# EAGLE design controller (EAGLE 6.6.0)
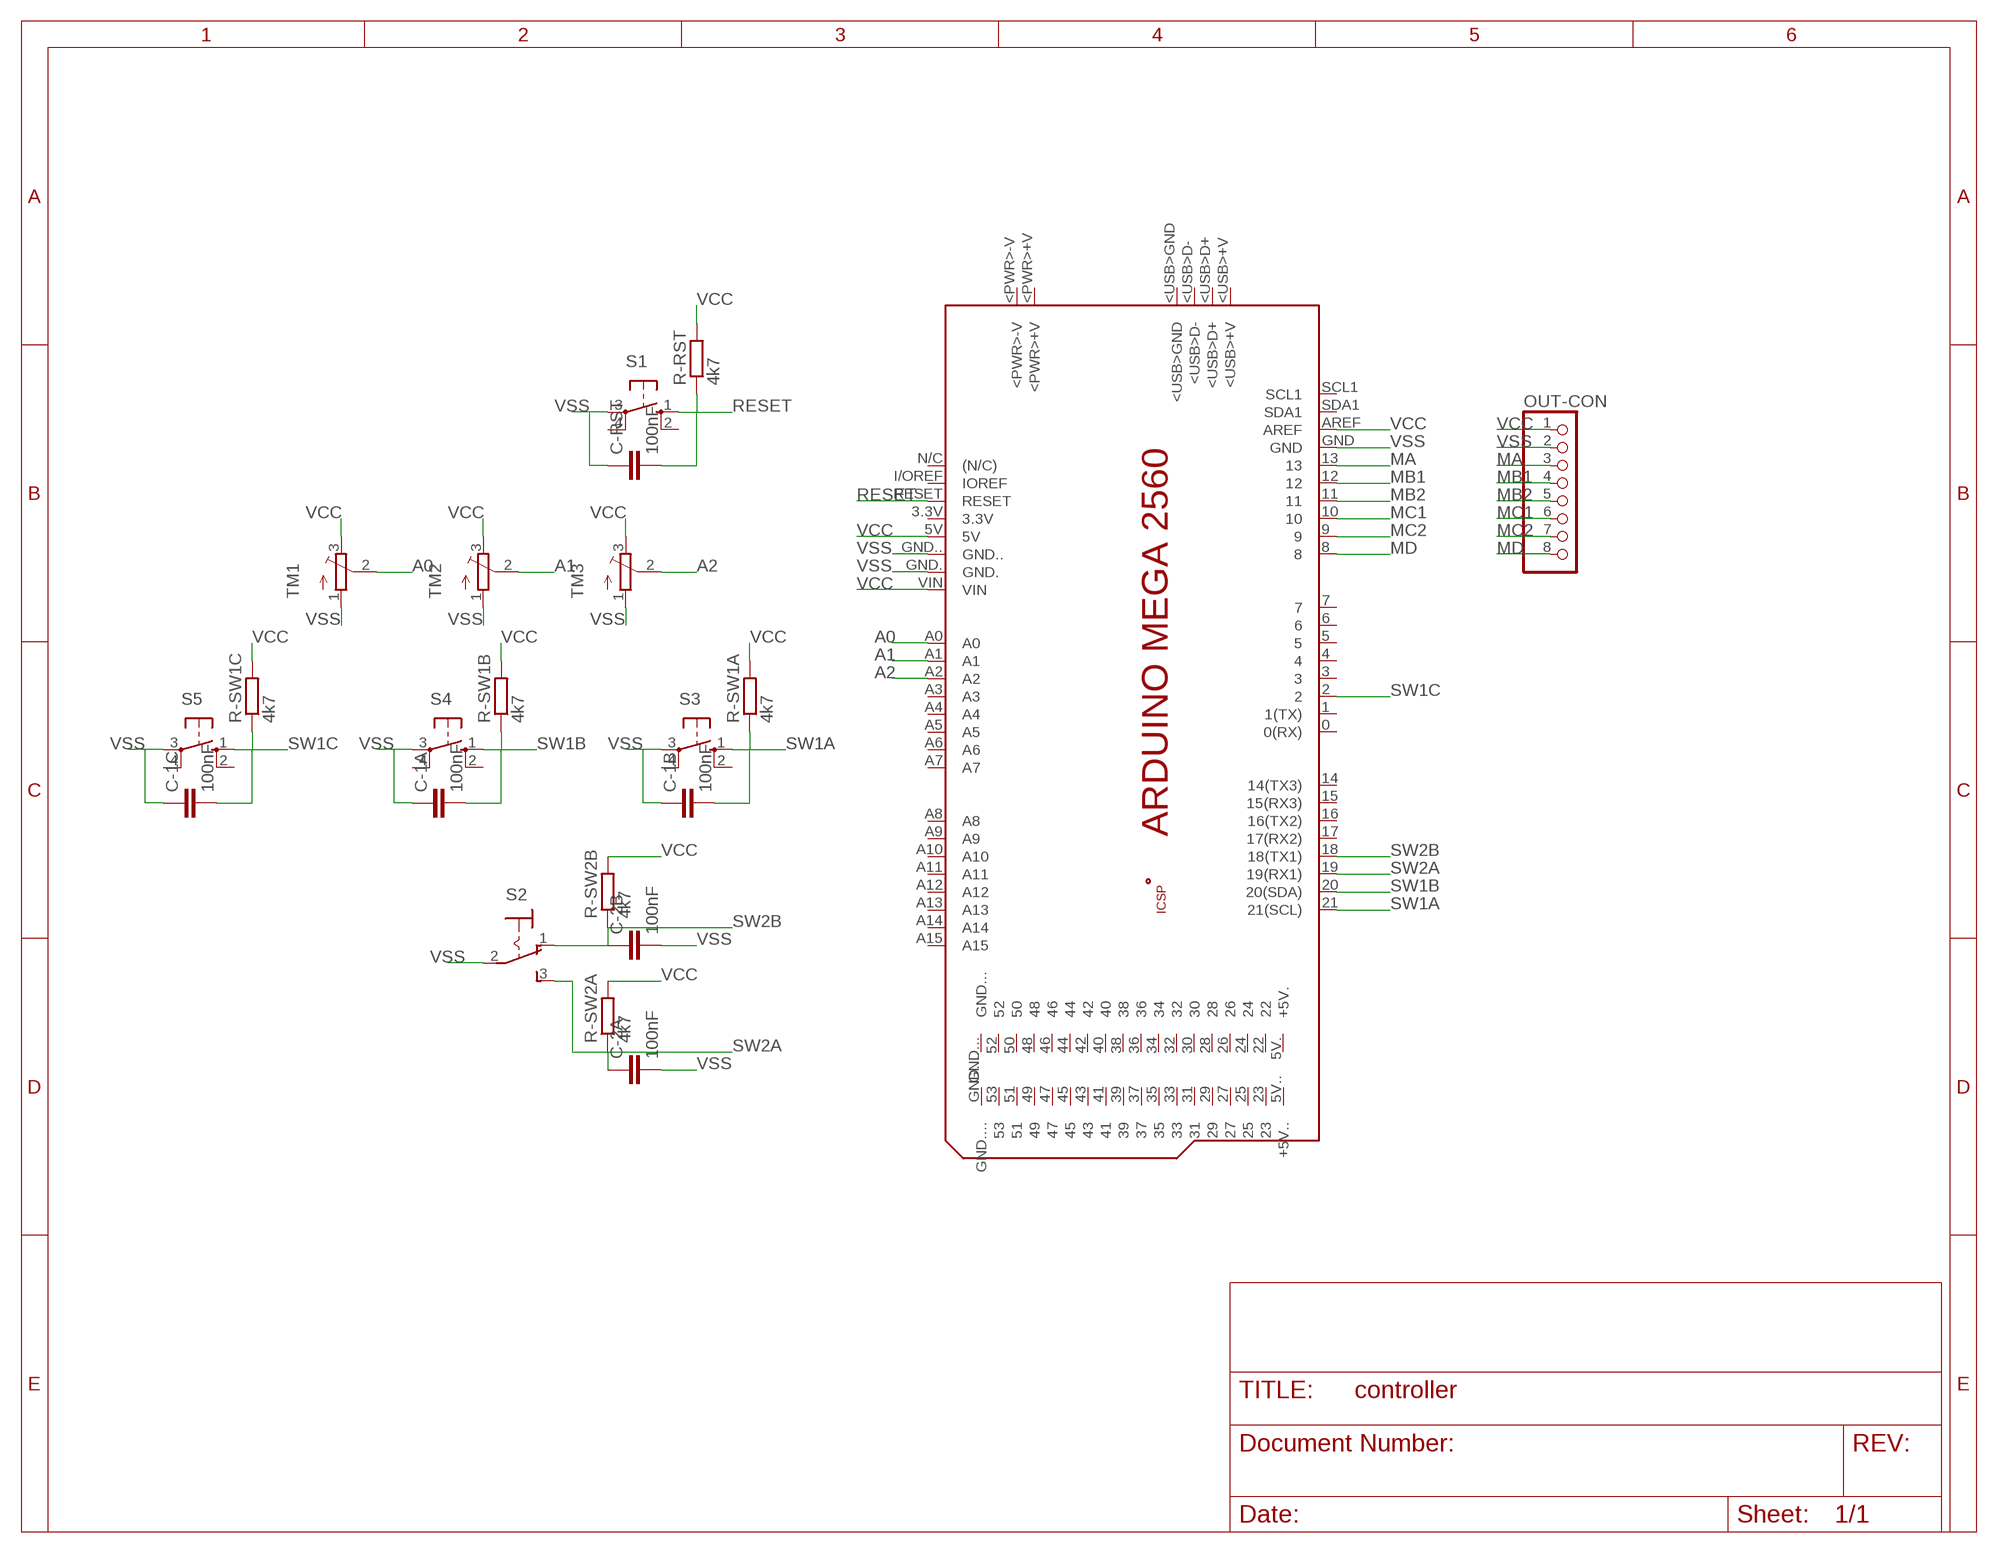
[diagram p0: schematic, sheet 1]

## Parts
C-1A  100nF  C-EU025-024X044  [C025-024X044]
C-1B  100nF  C-EU025-024X044  [C025-024X044]
C-1C  100nF  C-EU025-024X044  [C025-024X044]
C-2A  100nF  C-EU025-024X044  [C025-024X044]
C-2B  100nF  C-EU025-024X044  [C025-024X044]
C-RST  100nF  C-EU025-024X044  [C025-024X044]
OUT-CON  PINHD-1X8  [1X08]
PCB1  ARDUINO_MEGA2560  [ARDUINO_MEGA2560]
R-RST  4k7  R-EU_0204/7  [0204/7]
R-SW1A  4k7  R-EU_0204/7  [0204/7]
R-SW1B  4k7  R-EU_0204/7  [0204/7]
R-SW1C  4k7  R-EU_0204/7  [0204/7]
R-SW2A  4k7  R-EU_0204/7  [0204/7]
R-SW2B  4k7  R-EU_0204/7  [0204/7]
S1  10-XX  [B3F-10XX]
S2  M9040P  [M9040P]
S3  10-XX  [B3F-10XX]
S4  10-XX  [B3F-10XX]
S5  10-XX  [B3F-10XX]
TM1  TRIMPOT3386  [TRIM-3386]
TM2  TRIMPOT3386  [TRIM-3386]
TM3  TRIMPOT3386  [TRIM-3386]

## Nets
A0: PCB1.A0 TM1.2(S)
A1: PCB1.A1 TM2.2(S)
A2: PCB1.A2 TM3.2(S)
MA: OUT-CON.3 PCB1.13
MB1: OUT-CON.4 PCB1.12
MB2: OUT-CON.5 PCB1.11
MC1: OUT-CON.6 PCB1.10
MC2: OUT-CON.7 PCB1.9
MD: OUT-CON.8 PCB1.8
RESET: C-RST.2 PCB1.RESET R-RST.1 S1.1(S)
SW1A: C-1B.2 PCB1.21(21(SCL)) R-SW1A.1 S3.1(S)
SW1B: C-1A.2 PCB1.20(20(SDA)) R-SW1B.1 S4.1(S)
SW1C: C-1C.2 PCB1.2 R-SW1C.1 S5.1(S)
SW2A: C-2A.1 PCB1.19(19(RX1)) R-SW2A.1 S2.3(S)
SW2B: C-2B.1 PCB1.18(18(TX1)) R-SW2B.1 S2.1(O)
VCC: OUT-CON.1 PCB1.5V PCB1.AREF PCB1.VIN R-RST.2 R-SW1A.2 R-SW1B.2 R-SW1C.2 R-SW2A.2 R-SW2B.2 TM1.3(E) TM2.3(E) TM3.3(E)
VSS: C-1A.1 C-1B.1 C-1C.1 C-2A.2 C-2B.2 C-RST.1 OUT-CON.2 PCB1.GND PCB1.GND. PCB1.GND.. S1.3(P) S2.2(P) S3.3(P) S4.3(P) S5.3(P) TM1.1(A) TM2.1(A) TM3.1(A)
Unconnected: PCB1.0(0(RX)) PCB1.1(1(TX)) PCB1.3 PCB1.3.3V PCB1.4 PCB1.5 PCB1.5V.(+5V.) PCB1.5V..(+5V..) PCB1.6 PCB1.7 PCB1.14(14(TX3)) PCB1.15(15(RX3)) PCB1.16(16(TX2)) PCB1.17(17(RX2)) PCB1.22 PCB1.23 PCB1.24 PCB1.25 PCB1.26 PCB1.27 PCB1.28 PCB1.29 PCB1.30 PCB1.31 PCB1.32 PCB1.33 PCB1.34 PCB1.35 PCB1.36 PCB1.37 PCB1.38 PCB1.39 PCB1.40 PCB1.41 PCB1.42 PCB1.43 PCB1.44 PCB1.45 PCB1.46 PCB1.47 PCB1.48 PCB1.49 PCB1.50 PCB1.51 PCB1.52 PCB1.53 PCB1.+5V_ PCB1.<PWR>+V PCB1.<PWR>-V PCB1.<USB>+V PCB1.<USB>D+ PCB1.<USB>D- PCB1.<USB>GND PCB1.A3 PCB1.A4 PCB1.A5 PCB1.A6 PCB1.A7 PCB1.A8 PCB1.A9 PCB1.A10 PCB1.A11 PCB1.A12 PCB1.A13 PCB1.A14 PCB1.A15 PCB1.GND... PCB1.GND.... PCB1.GND__ PCB1.I/OREF(IOREF) PCB1.MISO PCB1.MOSI PCB1.N/C((N/C)) PCB1.RESET. PCB1.SCK PCB1.SCL1 PCB1.SDA1 S1.2(S1) S1.4(P1) S3.2(S1) S3.4(P1) S4.2(S1) S4.4(P1) S5.2(S1) S5.4(P1)

## Library data of the parts
C-1A C-1B C-1C C-2A C-2B C-RST = resistor:C-EU: CAPACITOR, European symbol
OUT-CON = pinhead:PINHD-1X8: PIN HEADER
PCB1 = E14_Arduino_revB:ARDUINO_MEGA2560: Device for representing an Arduino Mega 2560 board with a footprint in an EAGLE design. Created by Dave Young for Element14. More EAGLE documentation at: http://www.element14.com/community/community/knode/cadsoft_eagle
R-RST R-SW1A R-SW1B R-SW1C R-SW2A R-SW2B = resistor:R-EU_: RESISTOR, European symbol
S1 S3-S5 = switch-omron:10-XX: OMRON SWITCH; MPN: B3F-1000; OC_FARNELL: 176432; OC_NEWARK: 36M3542
S2 = switch:M9040P: TOGGLE SWITCH Marquardt
TM1-TM3 = adafruit2:TRIMPOT: SMT trimmer potentiometer part number TC33X http://www.ladyada.net/library/eagle

## Board
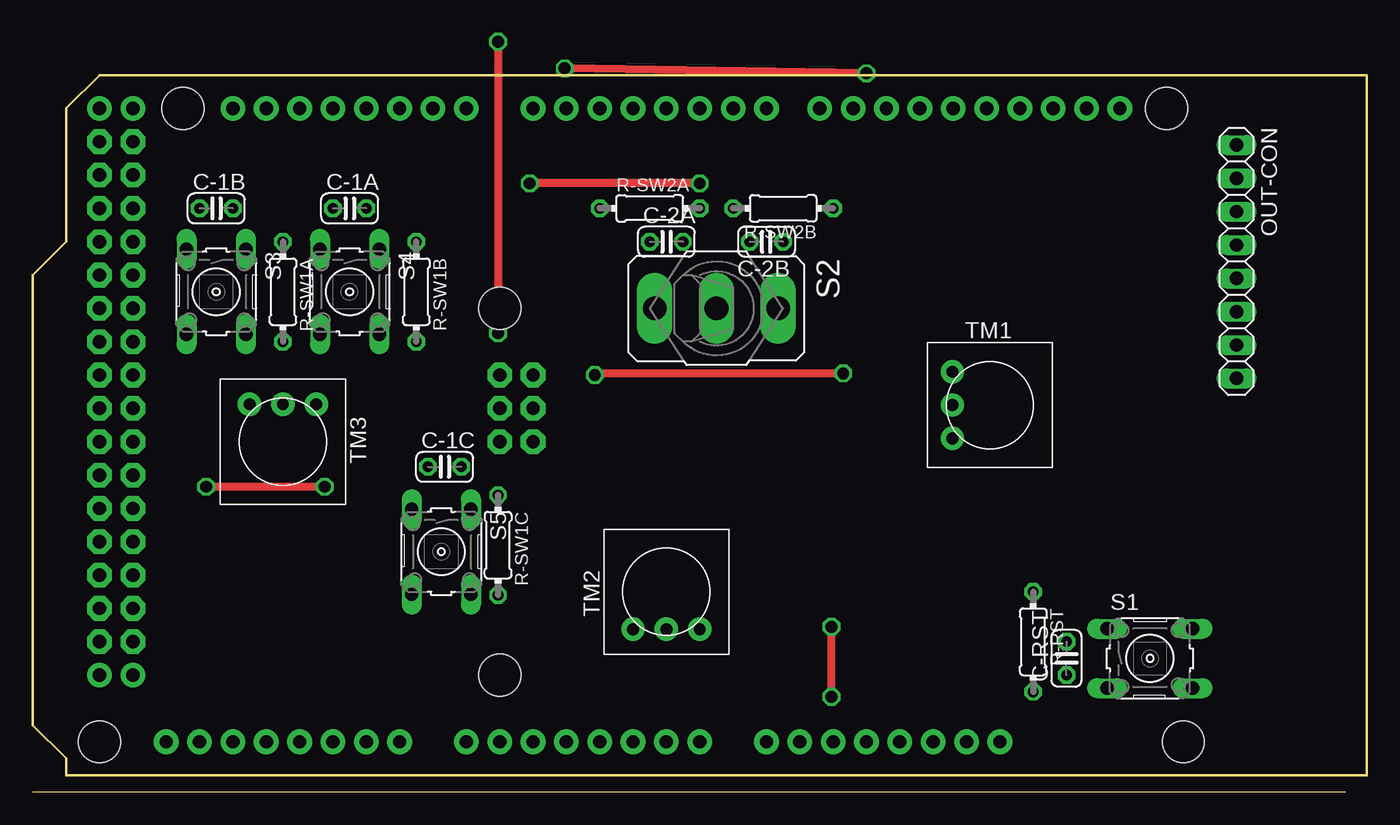
[diagram p1: board, top side]
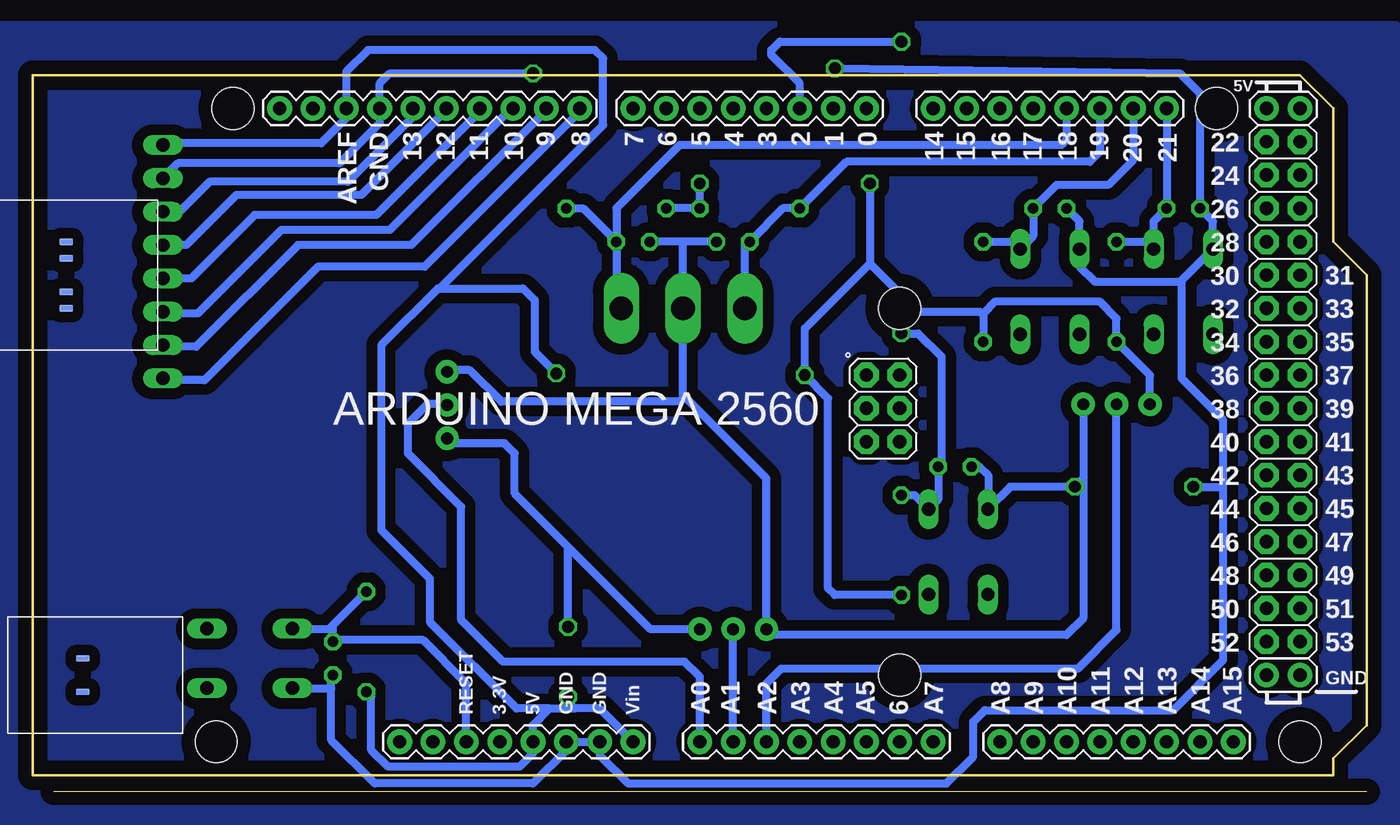
[diagram p2: board, bottom side, seen from below]

Size 101.6 x 54.61 mm. Coordinates in mm from the lower left corner, seen from the top.
Outline: 0,0 100,0
Copper layers (1*16): Top 0.035mm / dielectric 1.5mm / Bottom 0.035mm
Design rules "default": minimum track width 10mil, minimum drill 24mil, track to track 8mil, track to pad 8mil, pad to pad 8mil, via to via 8mil, smd to smd 8mil, copper to edge 40mil, drill to drill 8mil, minimum pad ring 10mil, minimum via ring 8mil, stop-mask expansion 4mil, vias tented up to drill 0mil, thermal gap 10mil

### Footprints (pad centres in the part's own frame; a part is rotated, then mirrored left to right if it is on the bottom)
C025-024X044 = drill 0.813 octagon: 1 -1.27,0; 2 1.27,0
1X08 = drill 1.016 long: 1 -8.89,0; 2 -6.35,0; 3 -3.81,0; 4 -1.27,0; 5 1.27,0; 6 3.81,0; 7 6.35,0; 8 8.89,0
ARDUINO_MEGA2560 = drill 1.016 pad 1.88: 0 63.5,50.8; 1 60.96,50.8; 2 58.42,50.8; 3 55.88,50.8; 3.3V 35.56,2.54; 4 53.34,50.8; 5 50.8,50.8; 5V 38.1,2.54; 5V. 93.98,50.8; 5V.. 96.52,50.8; 6 48.26,50.8; 7 45.72,50.8; 8 41.656,50.8; 9 39.116,50.8; 10 36.576,50.8; 11 34.036,50.8; 12 31.496,50.8; 13 28.956,50.8; 14 68.58,50.8; 15 71.12,50.8; 16 73.66,50.8; 17 76.2,50.8; 18 78.74,50.8; 19 81.28,50.8; 20 83.82,50.8; 21 86.36,50.8; A0 50.8,2.54; A1 53.34,2.54; A2 55.88,2.54; A3 58.42,2.54; A4 60.96,2.54; A5 63.5,2.54; A6 66.04,2.54; A7 68.58,2.54; A8 73.66,2.54; A9 76.2,2.54; A10 78.74,2.54; A11 81.28,2.54; A12 83.82,2.54; A13 86.36,2.54; A14 88.9,2.54; A15 91.44,2.54; AREF 23.876,50.8; GND 26.416,50.8; GND. 43.18,2.54; GND.. 40.64,2.54; GND... 93.98,7.62; GND.... 96.52,7.62; I/OREF 30.48,2.54; N/C 27.94,2.54; RESET 33.02,2.54; SCL1 18.796,50.8; SDA1 21.336,50.8; VIN 45.72,2.54 | drill 1.016 pad 1.88 octagon: 22 93.98,48.26; 23 96.52,48.26; 24 93.98,45.72; 25 96.52,45.72; 26 93.98,43.18; 27 96.52,43.18; 28 93.98,40.64; 29 96.52,40.64; 30 93.98,38.1; 31 96.52,38.1; 32 93.98,35.56; 33 96.52,35.56; 34 93.98,33.02; 35 96.52,33.02; 36 93.98,30.48; 37 96.52,30.48; 38 93.98,27.94; 39 96.52,27.94; 40 93.98,25.4; 41 96.52,25.4; 42 93.98,22.86; 43 96.52,22.86; 44 93.98,20.32; 45 96.52,20.32; 46 93.98,17.78; 47 96.52,17.78; 48 93.98,15.24; 49 96.52,15.24; 50 93.98,12.7; 51 96.52,12.7; 52 93.98,10.16; 53 96.52,10.16; +5V_ 66.04,30.48; GND__ 66.04,25.4; MISO 63.5,30.48; MOSI 66.04,27.94; RESET. 63.5,25.4; SCK 63.5,27.94 | smd 1.016 x 0.508: <PWR>+V 3.81,8.89; <PWR>-V 3.81,6.35; <USB>+V 2.54,40.64; <USB>D+ 2.54,39.37; <USB>D- 2.54,36.83; <USB>GND 2.54,35.56 | hole 3.2: 15.24,50.8; 13.97,2.54; 66.04,35.56; 66.04,7.62; 90.17,50.8; 96.52,2.54
0204/7 = drill 0.813 octagon: 1 -3.81,0; 2 3.81,0
B3F-10XX = drill 1.016 long: 1 -3.251,2.261; 2 3.251,2.261; 3 -3.251,-2.261; 4 3.251,-2.261
M9040P = drill 1.803 long: 1 0,4.699; 2 0,0; 3 0,-4.699
TRIM-3386 = drill 0.9 pad 1.778: 1 -2.54,-2.857; 2 0,-2.857; 3 2.54,-2.857

### Placement (x,y rotation side)
C-1A  24.13,44.45 0 top
C-1B  13.97,44.45 0 top
C-1C  31.37,24.77 0 top
C-2A  48.26,41.91 0 top
C-2B  55.88,41.91 180 top
C-RST  78.74,10.16 90 top
OUT-CON  91.69,40.39 270 top
PCB1  101.6,1.27 0 bottom
R-RST  76.2,11.43 270 top
R-SW1A  19.05,38.1 270 top
R-SW1B  29.21,38.1 270 top
R-SW1C  35.43,18.8 270 top
R-SW2A  46.99,44.45 0 top
R-SW2B  57.15,44.45 180 top
S1  85.09,10.16 0 top
S2  52.07,36.83 270 top
S3  13.97,38.1 270 top
S4  24.13,38.1 270 top
S5  31.11,18.29 270 top
TM1  72.9,29.46 270 top
TM2  48.26,15.24 0 top
TM3  19.05,26.67 180 top

### Tracks (layer width: path | path; a pad name or v marks a point on that pad's centre or on a via)
A0
  Bottom 0.61: PCB1.A0 50.8,8.76 51.94,9.91 65.79,9.91 68.96,13.08 68.96,21.72 73.03,25.78 73.03,28.07 71.5,29.59 70.17,29.59 TM1.2
A1
  Bottom 0.61: PCB1.A1 TM2.2
A2
  Bottom 0.61: PCB1.A2 45.72,8.26 44.58,9.4 21.97,9.4 19.05,12.32 TM3.2
MA
  Bottom 0.61: PCB1.13 72.64,51.44 77.6,46.48 88.14,46.48 90.42,44.2 OUT-CON.3
MB1
  Bottom 0.61: PCB1.12 70.1,51.94 76.58,45.47 86.11,45.47 89.92,41.66 OUT-CON.4
MB2
  Bottom 0.61: PCB1.11 67.56,51.82 75.44,43.94 84.71,43.94 89.53,39.12 OUT-CON.5
MC1
  Bottom 0.61: PCB1.10 65.15,52.07 74.42,42.8 82.68,42.8 89.03,36.45 91.57,36.45 OUT-CON.6
MC2
  Bottom 0.61: PCB1.9 62.48,51.94 72.77,41.66 81.41,41.66 89.15,33.91 91.57,33.91 OUT-CON.7
MD
  Bottom 0.61: PCB1.8 59.94,51.82 71.75,40.01 79.88,40.01 88.52,31.37 91.57,31.37 OUT-CON.8
N$1
  pour Bottom (isolate 0.813): -2.29,58.42 104.01,58.42 104.01,-2.92 -2.29,-2.92
RESET
  Bottom 0.61: PCB1.RESET 68.58,8.26 71.88,11.56 78.61,11.56 C-RST.2 78.74,12.7 | 78.74,12.7 R-RST.1 | S1.1 79.02,12.42 78.74,12.7
SW1A
  Bottom 0.61: PCB1.21 C-1B.2 16.23,43.46 S3.1 16.79,41.91 R-SW1A.1
SW1B
  Bottom 0.61: PCB1.20 17.78,48.13 19.68,46.23 23.62,46.23 C-1A.2 25.4,42.34 S4.1 26.95,41.91 R-SW1B.1
SW1C  (via drill 0.9)
  Top 0.61: v35.43,57.15 v35.43,34.92
  Bottom 0.61: R-SW1C.1 34.44,22.61 S5.1 32.64,22.28 C-1C.2 32.38,25.02 32.38,33.15 34.16,34.92 v35.43,34.92 | PCB1.2 43.18,53.98 45.34,56.13 45.34,56.52 44.7,57.15 v35.43,57.15
SW2A
  Bottom 0.61: PCB1.19 20.32,48.77 21.08,48.01 39.62,48.01 R-SW2A.1 44.45,44.45 C-2A.1 47.37,41.53 S2.3
SW2B
  Bottom 0.61: PCB1.18 22.86,49.66 23.24,49.28 52.32,49.28 57.15,44.45 C-2B.1 | R-SW2B.1 59.69,44.45 C-2B.1 | C-2B.1 57.15,37.21 S2.1
VCC  (via drill 0.9)
  Top 0.61: v50.8,46.35 v37.85,46.35 | v60.83,7.24 v60.83,12.57 | v61.72,31.88 42.93,31.88 v42.8,31.75
  Bottom 0.61: R-RST.2 75.82,7.24 75.82,3.17 74.55,1.91 64.52,1.91 63.5,2.92 PCB1.5V 63.5,5.08 62.23,6.35 | 62.23,6.35 60.33,6.35 | PCB1.VIN 58.42,6.35 60.33,6.35 | TM3.3 16.51,31.75 R-SW1A.2 19.05,36.07 20.32,37.34 28.32,37.34 29.21,36.45 29.21,36.32 | 29.21,36.32 R-SW1B.2 | R-SW2B.2 R-SW2A.2 v50.8,46.35 | TM2.3 54.55,12.38 60.83,18.67 | 60.83,18.67 64.9,22.73 64.9,25.78 65.66,26.54 69.66,26.54 TM1.3 | OUT-CON.1 91.57,49.4 79.63,49.4 77.72,51.31 PCB1.AREF 77.72,54.86 76.07,56.52 58.8,56.52 58.17,55.88 58.17,50.8 70.61,38.35 | 62.23,6.35 64.77,6.35 71.37,12.95 71.37,16.26 75.06,19.94 75.06,34.04 70.74,38.35 70.61,38.35 | v37.85,46.35 37.85,40.26 | 37.85,40.26 34.16,36.58 29.46,36.58 29.21,36.32 | 60.33,6.35 60.83,6.86 v60.83,7.24 | v60.83,12.57 60.83,18.67 | 70.61,38.35 64.26,38.35 63.37,37.47 63.37,33.53 v61.72,31.88 | 37.85,40.26 42.8,35.31 v42.8,31.75 41.02,29.97 41.02,15.49 40.51,14.99 R-SW1C.2
VSS  (via drill 0.9)
  Top 0.61: v63.5,54.74 v40.51,55.12 | v22.23,23.24 v13.21,23.24
  Bottom 0.61: 78.87,7.87 78.87,3.94 75.56,0.64 63.5,0.64 60.96,3.17 PCB1.GND.. PCB1.GND. 58.42,2.79 56.26,0.64 32,0.64 29.97,2.67 29.97,5.33 29.08,6.22 14.73,6.22 10.92,10.03 10.92,23.24 | 78.87,7.87 78.87,8.76 C-RST.1 | S1.3 78.89,7.9 78.87,7.87 | C-1A.1 21.87,43.46 S4.3 21.87,40.03 20.7,38.86 14.2,38.86 | 14.2,38.86 S3.3 11.71,43.46 C-1B.1 12.7,53.21 14.22,54.74 v40.51,55.12 | C-2A.2 51.94,41.91 | 51.94,41.91 C-2B.2 | 51.94,41.91 52.07,41.78 S2.2 52.07,30.23 51.94,30.1 | 51.94,30.1 45.72,23.88 TM2.1 45.28,11.94 22.86,11.94 21.59,13.21 TM3.1 21.59,23.88 v22.23,23.24 27.15,23.24 S5.3 28.83,21.57 28.83,24.13 29.46,24.77 C-1C.1 | OUT-CON.2 90.55,47.88 78.23,47.88 75.18,50.93 PCB1.GND 75.18,53.98 74.42,54.74 v63.5,54.74 | 10.92,23.24 10.92,28.32 14.1,31.5 14.1,38.76 14.2,38.86 | 51.94,30.1 52.32,29.72 65.91,29.72 68.33,32.13 69.91,32.13 TM1.1 | v13.21,23.24 10.92,23.24